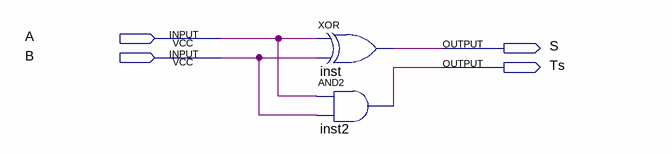
[diagram p0: schematic sheet]
// Quartus schematic meiosomador.bdf as structural Verilog: 2 symbols, 4 pins
module meiosomador (
  input  A,
  input  B,
  output S,
  output Ts
);

  xor inst (S, A, B);
  and inst2 (Ts, A, B);
endmodule
